# EAGLE design cowsynth_teensy_breakout_revA (EAGLE 9.4.0)
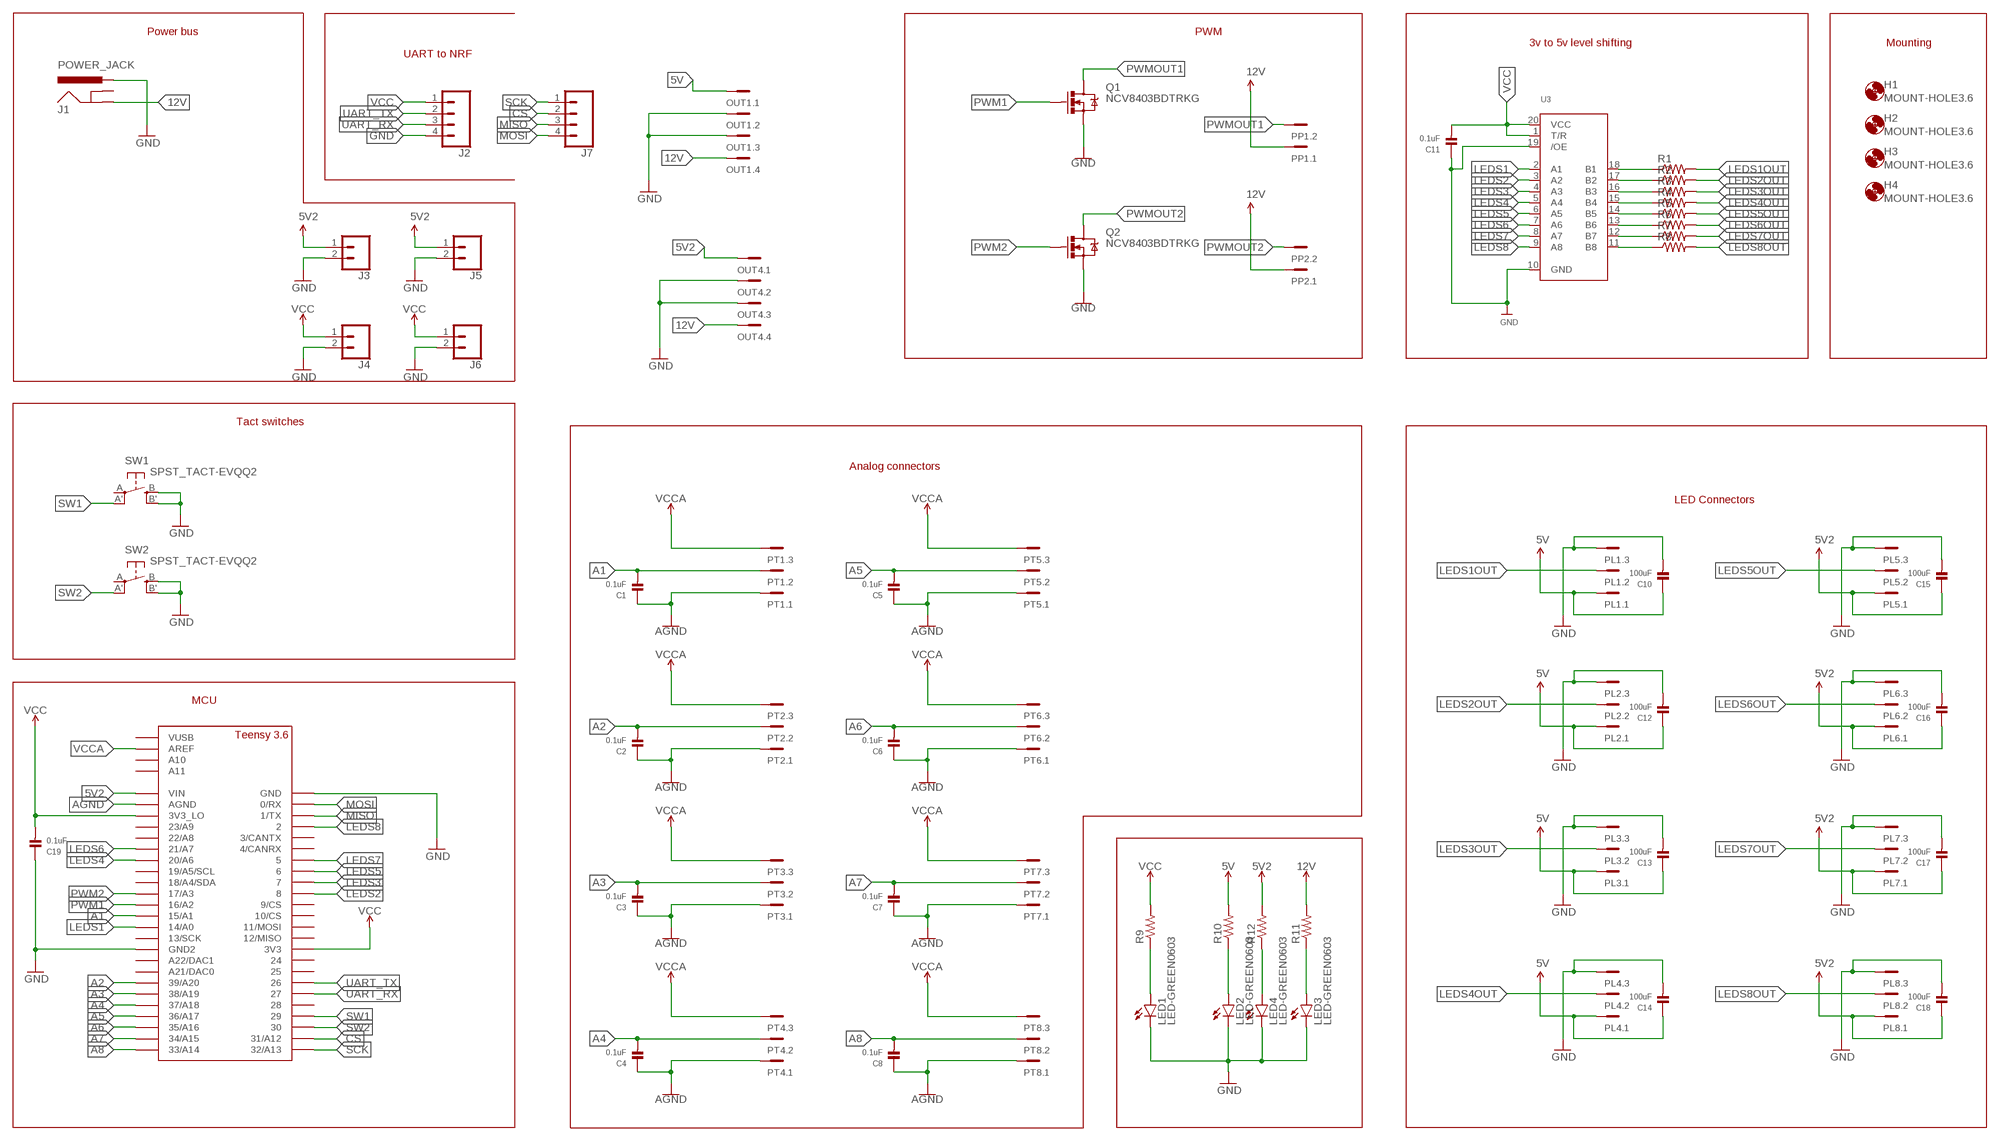
[diagram p0: schematic, sheet 1]

## Parts
C1  0.1uF  CAP_CERAMIC0603  [0603]
C2  0.1uF  CAP_CERAMIC0603  [0603]
C3  0.1uF  CAP_CERAMIC0603  [0603]
C4  0.1uF  CAP_CERAMIC0603  [0603]
C5  0.1uF  CAP_CERAMIC0603  [0603]
C6  0.1uF  CAP_CERAMIC0603  [0603]
C7  0.1uF  CAP_CERAMIC0603  [0603]
C8  0.1uF  CAP_CERAMIC0603  [0603]
C10  100uF  CAP_CERAMIC1206  [1206]
C11  0.1uF  CAP_CERAMIC0603  [0603]
C12  100uF  CAP_CERAMIC1206  [1206]
C13  100uF  CAP_CERAMIC1206  [1206]
C14  100uF  CAP_CERAMIC1206  [1206]
C15  100uF  CAP_CERAMIC1206  [1206]
C16  100uF  CAP_CERAMIC1206  [1206]
C17  100uF  CAP_CERAMIC1206  [1206]
C18  100uF  CAP_CERAMIC1206  [1206]
C19  0.1uF  CAP_CERAMIC0603  [0603]
H1  MOUNT-HOLE3.6  [3,6]
H2  MOUNT-HOLE3.6  [3,6]
H3  MOUNT-HOLE3.6  [3,6]
H4  MOUNT-HOLE3.6  [3,6]
J1  POWER_JACK  [POWER_JACK_PTH]
J2  CONN_04  [1X04]
J3  CONN_02  [1X02]
J4  CONN_02  [1X02]
J5  CONN_02  [1X02]
J6  CONN_02  [1X02]
J7  CONN_04  [1X04]
LED1  LED-GREEN0603  [0603-GREEN]
LED2  LED-GREEN0603  [0603-GREEN]
LED3  LED-GREEN0603  [0603-GREEN]
LED4  LED-GREEN0603  [0603-GREEN]
OUT1  MC4  [MC4]
OUT4  MC4  [MC4]
PL1  MC3  [MC3]
PL2  MC3  [MC3]
PL3  MC3  [MC3]
PL4  MC3  [MC3]
PL5  MC3  [MC3]
PL6  MC3  [MC3]
PL7  MC3  [MC3]
PL8  MC3  [MC3]
PP1  MC2  [MC2]
PP2  MC2  [MC2]
PT1  MC3  [MC3]
PT2  MC3  [MC3]
PT3  MC3  [MC3]
PT4  MC3  [MC3]
PT5  MC3  [MC3]
PT6  MC3  [MC3]
PT7  MC3  [MC3]
PT8  MC3  [MC3]
Q1  NCV8403BDTRKG  MOSFET-NCHANNELFDD8780  [DPAK]
Q2  NCV8403BDTRKG  MOSFET-NCHANNELFDD8780  [DPAK]
R1  R-US_R0603  [R0603]
R2  R-US_R0603  [R0603]
R3  R-US_R0603  [R0603]
R4  R-US_R0603  [R0603]
R5  R-US_R0603  [R0603]
R6  R-US_R0603  [R0603]
R7  R-US_R0603  [R0603]
R8  R-US_R0603  [R0603]
R9  R-US_R0603  [R0603]
R10  R-US_R0603  [R0603]
R11  R-US_R0603  [R0603]
R12  R-US_R0603  [R0603]
SW1  SPST_TACT-EVQQ2  [EVQ-Q2]
SW2  SPST_TACT-EVQQ2  [EVQ-Q2]
U3  74LCX245  [TSSOP20]
U$1  TEENSY_3.5/3.6_BASIC  [TEENSY_3.5/3.6_BASIC]

## Nets
5V: C10.1 C12.1 C13.1 C14.1 OUT1.1 PL1.1 PL2.1 PL3.1 PL4.1 R10.2
5V2: C15.1 C16.1 C17.1 C18.1 J3.1 J5.1 OUT4.1 PL5.1 PL6.1 PL7.1 PL8.1 R12.2 U$1.VIN
12V: J1.GND OUT1.4 OUT4.4 PP1.1 PP2.1 R11.2
A1: C1.2 PT1.2 U$1.15/A1
A2: C2.2 PT2.2 U$1.39/A20
A3: C3.2 PT3.2 U$1.38/A19
A4: C4.2 PT4.2 U$1.37/A18
A5: C5.2 PT5.2 U$1.36/A17
A6: C6.2 PT6.2 U$1.35/A16
A7: C7.2 PT7.2 U$1.34/A15
A8: C8.2 PT8.2 U$1.33/A14
AGND: C1.1 C2.1 C3.1 C4.1 C5.1 C6.1 C7.1 C8.1 PT1.1 PT2.1 PT3.1 PT4.1 PT5.1 PT6.1 PT7.1 PT8.1 U$1.AGND
CS: J7.2 U$1.31/A12
GND: C10.2 C11.1 C12.2 C13.2 C14.2 C15.2 C16.2 C17.2 C18.2 C19.1 J1.PWR J2.4 J3.2 J4.2 J5.2 J6.2 LED1.C LED2.C LED3.C LED4.C OUT1.2 OUT1.3 OUT4.2 OUT4.3 PL1.3 PL2.3 PL3.3 PL4.3 PL5.3 PL6.3 PL7.3 PL8.3 Q1.3(S) Q2.3(S) SW1.B'(S1) SW1.B(S) SW2.B'(S1) SW2.B(S) U3.10(GND) U3.19(/OE) U$1.GND U$1.GND2
LEDS1: U3.2(A1) U$1.14/A0
LEDS1OUT: PL1.2 R1.2
LEDS2: U3.3(A2) U$1.8
LEDS2OUT: PL2.2 R2.2
LEDS3: U3.4(A3) U$1.7
LEDS3OUT: PL3.2 R3.2
LEDS4: U3.5(A4) U$1.20/A6
LEDS4OUT: PL4.2 R4.2
LEDS5: U3.6(A5) U$1.6
LEDS5OUT: PL5.2 R5.2
LEDS6: U3.7(A6) U$1.21/A7
LEDS6OUT: PL6.2 R6.2
LEDS7: U3.8(A7) U$1.5
LEDS7OUT: PL7.2 R7.2
LEDS8: U3.9(A8) U$1.2
LEDS8OUT: PL8.2 R8.2
MISO: J7.3 U$1.1/TX
MOSI: J7.4 U$1.0/RX
N$1: LED4.A R12.1
N$2: LED1.A R9.1
N$3: LED2.A R10.1
N$4: LED3.A R11.1
N$5: R1.1 U3.18(B1)
N$6: R2.1 U3.17(B2)
N$7: R3.1 U3.16(B3)
N$8: R4.1 U3.15(B4)
N$9: R5.1 U3.14(B5)
N$10: R6.1 U3.13(B6)
N$11: R7.1 U3.12(B7)
N$12: R8.1 U3.11(B8)
PWM1: Q1.1(G) U$1.16/A2
PWM2: Q2.1(G) U$1.17/A3
PWMOUT1: PP1.2 Q1.4(D)
PWMOUT2: PP2.2 Q2.4(D)
SCK: J7.1 U$1.32/A13
SW1: SW1.A'(P1) U$1.29
SW2: SW2.A'(P1) U$1.30
UART_RX: J2.3 U$1.27
UART_TX: J2.2 U$1.26
VCC: C11.2 C19.2 J2.1 J4.1 J6.1 R9.2 U3.1(T/R) U3.20(VCC) U$1.3V3 U$1.3V3_LO
VCCA: PT1.3 PT2.3 PT3.3 PT4.3 PT5.3 PT6.3 PT7.3 PT8.3 U$1.AREF
Unconnected: J1.GNDBREAK SW1.A(P) SW2.A(P) U$1.3/CANTX U$1.4/CANRX U$1.9/CS U$1.10/CS U$1.11/MOSI U$1.12/MISO U$1.13/SCK U$1.18/A4/SDA U$1.19/A5/SCL U$1.21/DAC0(A21/DAC0) U$1.22/A8 U$1.23/A9 U$1.24 U$1.25 U$1.28 U$1.A10 U$1.A11 U$1.A22/DAC1 U$1.VUSB

## Notes on the sheet
- Power bus | PWM
- 3v to 5v level shifting | Mounting
- UART to NRF
- Tact switches
- Analog connectors
- LED Connectors
- MCU

## Library data of the parts
C1-C8 C10-C19 = microbuilder:CAP_CERAMIC: Ceramic Capacitors 0402 - 0402 Surface Mount Capacitors 16pF 50V 5% [Digikey: 445-4899-2-ND] 18pF 50V 5% [Digikey: 490-1281-2-ND] 22pF 50V 5% [Digikey: 490-1283-2-ND] 68pF 50V 5% [Digikey: 490-1289-2-ND] 0.1uF 10V 10% [Digikey: 490-1318-2-ND] 1.0uF 6.3V 10% [Digikey: 490-1320-2-ND] 0603 - 0603 Surface Mount Capacitors 16 pF 50V 5% [Digikey: 445-5051-2-ND] 22 pF 50V [Digikey: PCC220ACVTR-ND] 33 pF 50V 5% [Digikey: 490-1415-1-ND] 56pF 50V 5% [Digikey: 490-1421-1-ND] 220pF 50V 5% [Digikey: 445-1285-1-ND] 680 pF 50V 2200 pF 50V 5% C0G [Digikey: 445-1297-1-ND] 5600 pF 100V 5% X7R [Digikey: 478-3711-1-ND] 0.1 µF 25V 10% [Digikey: PCC2277TR-ND] 0.22 µF 16V 10% X7R [Digikey: 445-1318-1-ND] 1.0 µF 25V 10% [Digikey: 445-5146-2-ND] 0603 - RF Specific 3pF 250V +/-0.1pF RF [Digikey: 712-1347-1-ND] 18 pF 250V 5% [Digikey: 478-3505-1-ND or 712-1322-1-ND] 56 pF 250V 5% C0G RF [Digikey: 490-4867-1-ND] 68 pF 250V RF [Digikey: 490-4868-1-ND] 0805 - 0805 Surface Mount Capacitors 220 pF 250V 2% RF Ceramic Capacitor [Digikey: 712-1398-1-ND] 1000 pF 50V 2% NP0 Ceramic Capacitor [Digikey: 478-3760-1-ND] 0.1 µF 25V 10% Ceramic Capacitor [Digikey: PCC1828TR-ND] 1.0 µF 16V 10% Ceramic Capacitor[Digikey: 490-1691-2-ND] 10.0 µF 10V 10% Ceramic Capacitor[Digikey: 709-1228-1-ND] 10.0 uF 16V 10% Ceramic Capacitor [Digikey: 478-5165-2-ND] 47 uF 6.3V 20% Ceramic Capacitor [Digikey: 587-1779-1-ND or 399-5506-1-ND] 1206 - 1206 Surface Mount Capacitors 47uF 10V 20% Ceramic Capacitor [Digikey: 490-5528-1-ND or 399-5508-1-ND or 445-6010-1-ND] 100uF 6.3V -20%, +80% Y5V Ceramic Capacitor (Digikey: 490-4512-1-ND, Mouser: 81-GRM31CF50J107ZE1L)
H1-H4 = holes:MOUNT-HOLE: MOUNTING HOLE with drill center marker
J1 = SparkFun-Connectors:POWER_JACK: Power Jack Connector This is the standard 5.5mm barrel jack for power. The PTH is the most common, proven, reliable, footprint. The Slot footprint only works if the mill layer is transmitted to the PCB fab house so be warned. Here are the connectors we sell at SparkFun: DC Barrel Power Jack/Connector <https://www.sparkfun.com/products/119> (PRT-00119) DC Barrel Power Jack/Connector (SMD) <https://www.sparkfun.com/products/12748> (PRT-12748) DC Barrel Jack Adapter - Breadboard Compatible <https://www.sparkfun.com/products/10811> (PRT-10811) It is used on this SparkFun product (and many, many others): SparkFun RedBoard - Programmed with Arduino <https://www.sparkfun.com/products/12757> (DEV-12757) Also, if you need a mating power supply or connector, please check these out: Wall Adapter Power Supply - 9VDC 650mA <https://www.sparkfun.com/products/298> (TOL-00298) DC Barrel Jack Adapter - Male <https://www.sparkfun.com/products/10287> (PRT-10287); PROD_ID: CONN-08197
J2 J7 = SparkFun-Connectors:CONN_04: Multi connection point. Often used as Generic Header-pin footprint for 0.1 inch spaced/style header connections On any of the 0.1 inch spaced packages, you can populate with these: Break Away Headers - Straight <https://www.sparkfun.com/products/116> (PRT-00116) Break Away Male Headers - Right Angle <https://www.sparkfun.com/products/553> (PRT-00553) Female Headers <https://www.sparkfun.com/products/115> (PRT-00115) Break Away Headers - Machine Pin <https://www.sparkfun.com/products/117> (PRT-00117) Break Away Female Headers - Swiss Machine Pin <https://www.sparkfun.com/products/743> (PRT-00743) For SCREWTERMINALS and SPRING TERMINALS visit here: Screw Terimnals on SparkFun.com <https://www.sparkfun.com/search/results?term=Screw+Terminals> (5mm/3.5mm/2.54mm spacing) This device is also useful as a general connection point to wire up your design to another part of your project. Our various solder wires solder well into these plated through hole pads. Hook-Up Wire - Assortment (Stranded, 22 AWG) <https://www.sparkfun.com/products/11375> (PRT-11375) Hook-Up Wire - Assortment (Solid Core, 22 AWG) <https://www.sparkfun.com/products/11367> (PRT-11367) View the entire wire category on our website here <https://www.sparkfun.com/categories/141> Special notes: Molex polarized connector foot print use with SKU : PRT-08231 with associated crimp pins and housings. 1MM SMD Version SKU: PRT-10208; PROD_ID: CONN-09696
J3-J6 = SparkFun-Connectors:CONN_02: Multi connection point. Often used as Generic Header-pin footprint for 0.1 inch spaced/style header connections On any of the 0.1 inch spaced packages, you can populate with these: Break Away Headers - Straight <https://www.sparkfun.com/products/116> (PRT-00116) Break Away Male Headers - Right Angle <https://www.sparkfun.com/products/553> (PRT-00553) Female Headers <https://www.sparkfun.com/products/115> (PRT-00115) Break Away Headers - Machine Pin <https://www.sparkfun.com/products/117> (PRT-00117) Break Away Female Headers - Swiss Machine Pin <https://www.sparkfun.com/products/743> (PRT-00743) For SCREWTERMINALS and SPRING TERMINALS visit here: Screw Terimnals on SparkFun.com <https://www.sparkfun.com/search/results?term=Screw+Terminals> (5mm/3.5mm/2.54mm spacing) This device is also useful as a general connection point to wire up your design to another part of your project. Our various solder wires solder well into these plated through hole pads. Hook-Up Wire - Assortment (Stranded, 22 AWG) <https://www.sparkfun.com/products/11375> (PRT-11375) Hook-Up Wire - Assortment (Solid Core, 22 AWG) <https://www.sparkfun.com/products/11367> (PRT-11367) View the entire wire category on our website here <https://www.sparkfun.com/categories/141> Special notes: Molex polarized connector foot print use with: PRT-08233 with associated crimp pins and housings. 2.54_SCREWTERM for use with PRT-10571. 3.5mm Screw Terminal footprints for PRT-08084 5mm Screw Terminal footprints for use with PRT-08432
LED1-LED4 = BeagleBone_Blue_R3:LED-GREEN
OUT1 OUT4 = con-phoenix-381_l:MC4: Mini-Combicon 3.81mm horizontal 4-polig (ohne Gegenstecker)
PL1-PL8 PT1-PT8 = con-phoenix-381_l:MC3: Mini-Combicon 3.81mm horizontal 3-polig (ohne Gegenstecker)
PP1 PP2 = con-phoenix-381_l:MC2: Mini-Combicon 3.81mm horizontal 2-polig (ohne Gegenstecker)
Q1 Q2 = BeagleBone_Blue_R3:MOSFET-NCHANNEL: Common NMOSFET Parts MFG P/N Store ID Prod ID FDD8780 TRANS-09984 SI7820DN TRANS-11055 FDS6630A IC-08089 2N7002PW TRANS-11151 FQP30N06L COM-10213 TRANS-10060 BSS123LT1G TRANS-08345 BSS138 TRANS-00830 BS170 2N7000; PROD_ID: TRANS-09984
R1-R12 = adafruit:R-US_: RESISTOR, American symbol
SW1 SW2 = adafruit:SPST_TACT: SMT 6mm switch, EVQQ2 series http://www.ladyada.net/library/eagle
U3 = microbuilder:74LCX245: 74LCX245MTC - 5.0V Tolerant Bi-Directional Buffer Can be used to interface 5.0V logic to 2.5 or 3.3V devices Digikey: 74LCX245MTCXTR-ND Mouser: 512-74LCX245MTCX
U$1 = Teensy356:TEENSY_3.5/3.6_BASIC

## Board
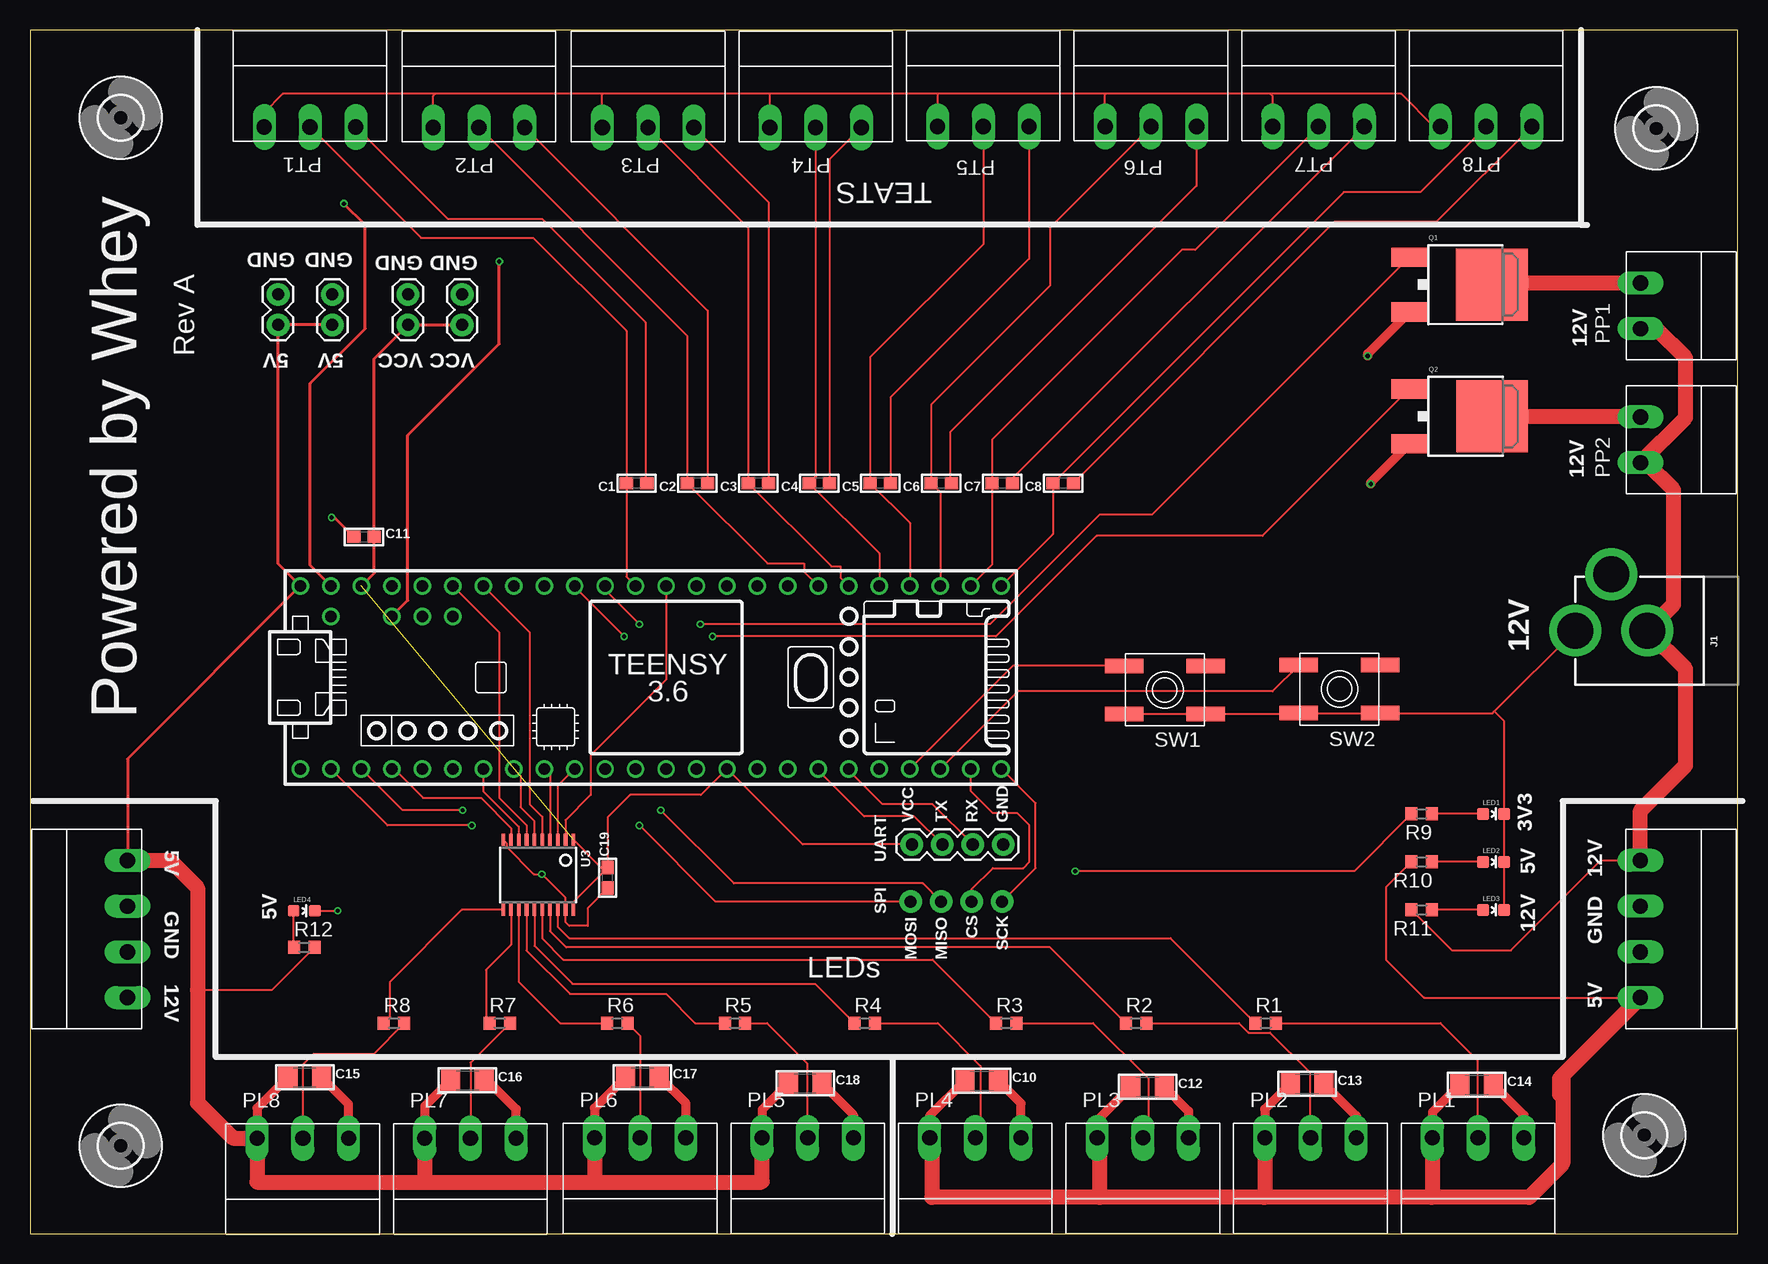
[diagram p1: board, top side]
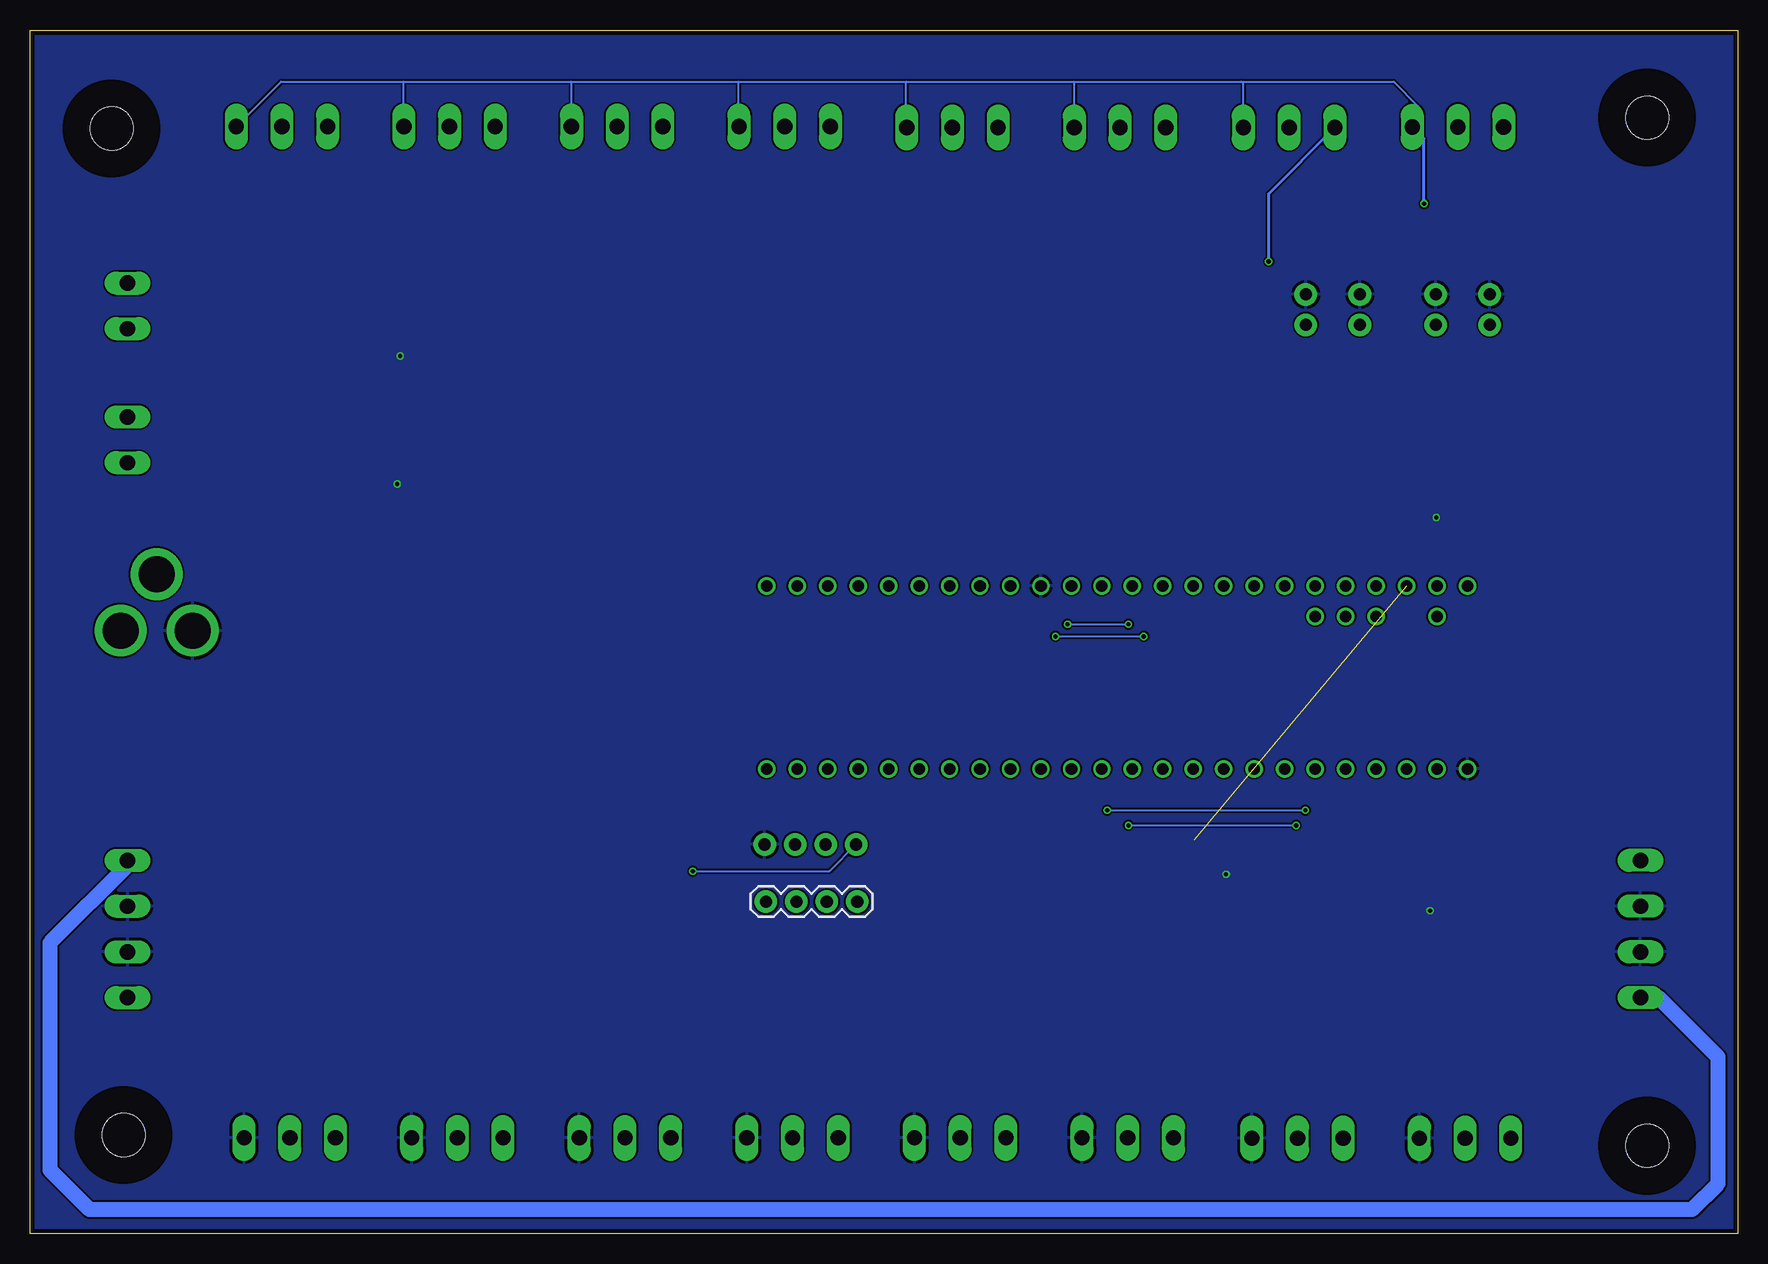
[diagram p2: board, bottom side, seen from below]

Size 142.37 x 100.32 mm. Coordinates in mm from the lower left corner, seen from the top.
Outline: 0,0 142.37,0 142.37,100.32 0,100.32 0,0
Copper layers (1*16): Top 0.035559375mm / dielectric 1.6mm / Bottom 0.035559375mm
Design rules "oshpark-2layer": minimum track width 6mil, minimum drill 10mil, track to track 6mil, track to pad 6mil, pad to pad 6mil, via to via 6mil, smd to smd 6mil, copper to edge 15mil, drill to drill 6mil, minimum pad ring 5mil, minimum via ring 5mil, stop-mask expansion 2.5mil, vias tented up to drill 0mil, thermal gap 10mil

### Footprints (pad centres in the part's own frame; a part is rotated, then mirrored left to right if it is on the bottom)
0603 = smd 1.1 x 1: 1 -0.85,0; 2 0.85,0
1206 = smd 1.6 x 1.8: 1 -1.4,0; 2 1.4,0
3,6 = hole 3.6: 0,0
POWER_JACK_PTH = drill 2.997 pad 4.318: GND 0,7.7; GNDBREAK 4.7,10.7; PWR 0,13.7
1X04 = drill 1.016 pad 1.88: 1 0,0; 2 2.54,0; 3 5.08,0; 4 7.62,0
1X02 = drill 1.016 pad 1.88: 1 0,0; 2 2.54,0
0603-GREEN = smd 1 x 1: A 0,-0.877; C 0,0.877
MC4 = drill 1.27 long: 1 -5.715,0; 2 -1.905,0; 3 1.905,0; 4 5.715,0
MC3 = drill 1.27 long: 1 -3.81,0; 2 0,0; 3 3.81,0
MC2 = drill 1.27 long: 1 -1.905,0; 2 1.905,0
DPAK = smd 1.6 x 2.997: 1 -2.28,-5.31; 3 2.28,-5.31 | smd 5.994 x 5.994: 4 0,1.588
R0603 = smd 1 x 1.1: 1 -0.85,0; 2 0.85,0
EVQ-Q2 = smd 3.2 x 1.2: A -3.4,-2; A' 3.4,-2; B -3.4,2; B' 3.4,2
TSSOP20 = smd 0.305 x 0.991: 1 -2.925,-2.918; 2 -2.275,-2.918; 3 -1.625,-2.918; 4 -0.975,-2.918; 5 -0.325,-2.918; 6 0.325,-2.918; 7 0.975,-2.918; 8 1.625,-2.918; 9 2.275,-2.918; 10 2.925,-2.918; 11 2.925,2.918; 12 2.275,2.918; 13 1.625,2.918; 14 0.975,2.918; 15 0.325,2.918; 16 -0.325,2.918; 17 -0.975,2.918; 18 -1.625,2.918; 19 -2.275,2.918; 20 -2.925,2.918
TEENSY_3.5/3.6_BASIC = drill 0.965: 0/RX -25.4,-7.62; 1/TX -22.86,-7.62; 2 -20.32,-7.62; 3/CANTX -17.78,-7.62; 3V3 7.62,-7.62; 3V3_LO -22.86,7.62; 4/CANRX -15.24,-7.62; 5 -12.7,-7.62; 6 -10.16,-7.62; 7 -7.62,-7.62; 8 -5.08,-7.62; 9/CS -2.54,-7.62; 10/CS 0,-7.62; 11/MOSI 2.54,-7.62; 12/MISO 5.08,-7.62; 13/SCK 5.08,7.62; 14/A0 2.54,7.62; 15/A1 0,7.62; 16/A2 -2.54,7.62; 17/A3 -5.08,7.62; 18/A4/SDA -7.62,7.62; 19/A5/SCL -10.16,7.62; 20/A6 -12.7,7.62; 21/A7 -15.24,7.62; 21/DAC0 12.7,7.62; 22/A8 -17.78,7.62; 23/A9 -20.32,7.62; 24 10.16,-7.62; 25 12.7,-7.62; 26 15.24,-7.62; 27 17.78,-7.62; 28 20.32,-7.62; 29 22.86,-7.62; 30 25.4,-7.62; 31/A12 27.94,-7.62; 32/A13 30.48,-7.62; 33/A14 30.48,7.62; 34/A15 27.94,7.62; 35/A16 25.4,7.62; 36/A17 22.86,7.62; 37/A18 20.32,7.62; 38/A19 17.78,7.62; 39/A20 15.24,7.62; A10 -17.78,5.08; A11 -15.24,5.08; A22/DAC1 10.16,7.62; AGND -25.4,7.62; AREF -20.32,5.08; GND -27.94,-7.62; GND2 7.62,7.62; VIN -27.94,7.62; VUSB -25.4,5.08

### Placement (x,y rotation side)
C1  50.56,62.56 180 top
C2  55.64,62.56 180 top
C3  60.72,62.56 180 top
C4  65.8,62.56 180 top
C5  70.88,62.56 180 top
C6  75.96,62.56 180 top
C7  81.04,62.56 180 top
C8  86.12,62.56 180 top
C10  79.33,12.76 0 top
C11  27.85,58.07 0 top
C12  93.16,12.25 0 top
C13  106.46,12.5 0 top
C14  120.58,12.42 0 top
C15  22.91,13.06 0 top
C16  36.47,12.8 0 top
C17  51.04,13.06 0 top
C18  64.61,12.55 0 top
C19  48.16,29.67 90 top
H1  7.56,93.01 0 top
H2  135.56,92.12 0 top
H3  134.56,8.23 0 top
H4  7.56,7.34 0 top
J1  142.51,50.27 90 top
J2  73.51,32.45 0 top
J3  25.19,75.75 90 top
J4  36.02,75.75 90 top
J5  20.69,75.75 90 top
J6  31.51,75.75 90 top
J7  81.03,27.69 0 bottom
LED1  122,35 270 top
LED2  122,31 270 top
LED3  122,27 270 top
LED4  22.86,26.92 270 top
OUT1  134.24,25.4 90 top
OUT4  8.13,25.4 270 top
PL1  120.71,8 0 top
PL2  106.74,8 0 top
PL3  92.77,8 0 top
PL4  78.8,8 0 top
PL5  64.83,8 0 top
PL6  50.86,8 0 top
PL7  36.71,7.97 0 top
PL8  22.74,7.97 0 top
PP1  134.25,77.33 90 top
PP2  134.25,66.17 90 top
PT1  23.34,92.25 180 top
PT2  37.42,92.2 180 top
PT3  51.52,92.2 180 top
PT4  65.49,92.2 180 top
PT5  79.46,92.28 180 top
PT6  93.43,92.28 180 top
PT7  107.4,92.28 180 top
PT8  121.37,92.28 180 top
Q1  120.28,79.1 270 top
Q2  120.29,68.13 270 top
R1  103.01,17.55 0 top
R2  92.2,17.55 0 top
R3  81.39,17.55 0 top
R4  69.58,17.55 0 top
R5  58.77,17.55 0 top
R6  48.96,17.55 0 top
R7  39.15,17.55 0 top
R8  30.34,17.55 0 top
R9  116,35 180 top
R10  116,31 180 top
R11  116,27 180 top
R12  22.86,23.88 0 top
SW1  94.6,45.34 180 top
SW2  109.16,45.4 180 top
U3  42.37,29.91 180 top
U$1  50.48,46.37 0 top

### Tracks (layer width: path | path; a pad name or v marks a point on that pad's centre or on a via)
5V
  Top 0.152: R10.2 113.03,28.88 113.03,22.86 116.2,19.68 OUT1.1
  Top 0.762: 74.99,9.71 PL4.1 74.99,9.82 C10.1 | 102.93,10.41 102.93,10.38 | 102.93,10.38 PL2.1 | C14.1 116.9,10.14 PL1.1 | C12.1 88.96,9.46 PL3.1 | C13.1 102.93,10.38
  Top 1.27: 127.51,11.59 127.51,12.95 127.76,13.21 | 127.76,13.21 127.76,5.84 124.97,3.05 116.84,3.05 | 116.84,3.05 102.87,3.05 | 102.87,3.05 89.15,3.05 | 89.15,3.05 75.18,3.05 75.18,7.81 PL4.1 | PL3.1 89.15,7.81 89.15,3.05 | PL2.1 102.93,3.11 102.87,3.05 | PL1.1 116.9,3.11 116.84,3.05 | OUT1.1 127.76,13.21
5V2
  Top 0.152: R12.2 20.15,20.32 13.97,20.32
  Top 0.254: OUT4.1 8.13,39.58 U$1.VIN 20.69,55.84 J5.1 J3.1
  Top 0.762: C18.1 61.02,10.36 PL5.1 | C17.1 47.05,10.47 PL6.1 | C16.1 32.9,10.64 PL7.1 | C15.1 18.93,10.48 PL8.1
  Top 1.27: OUT4.1 11.68,31.11 13.97,28.83 13.97,20.32 13.97,10.92 16.92,7.97 PL8.1 18.93,4.32 32.51,4.32 | 32.51,4.32 46.74,4.32 | 46.74,4.32 60.96,4.32 61.02,4.38 PL5.1 | PL6.1 47.05,4.63 46.74,4.32 | PL7.1 32.9,4.71 32.51,4.32
12V
  Top 0.152: R11.2 118.53,23.62 123.44,23.62 130.94,31.11 OUT1.4
  Top 1.27: PP1.1 135.57,75.43 138,73 138,68.02 PP2.1 134.73,64.27 137,62 137,52.46 J1.GND 138,47.08 138,39.03 134.24,35.27 OUT1.4
  Bottom 1.27: OUT1.4 134.24,30.72 140.72,24.24 140.72,5.34 137.41,2.03 3.81,2.03 1.65,4.19 1.65,14.73 6.6,19.68 OUT4.4
A1
  Top 0.152: PT1.2 32.59,83 41.95,83 49.71,75.24 C1.2 49.71,54.76 U$1.15/A1
A2
  Top 0.152: PT2.2 54.79,74.83 C2.2 61.47,55.88 64.52,55.88 64.52,55.19 U$1.39/A20
A3
  Top 0.152: PT3.2 59.87,83.85 C3.2 66.8,55.63 67.56,55.63 67.56,54.69 U$1.38/A19
A4
  Top 0.152: PT4.2 65.49,63.1 | C4.2 70.8,56.71 U$1.37/A18
  Top 0.254: 65.49,63.1 C4.2
A5
  Top 0.152: PT5.2 79.46,82.46 70.03,73.03 C5.2 73.34,59.25 U$1.36/A17
A6
  Top 0.152: PT6.2 85,83.84 85,79 75.11,69.11 C6.2 75.88,61.79 U$1.35/A16
A7
  Top 0.152: PT7.2 97.13,82 96,82 80.19,66.19 C7.2 80.19,55.76 U$1.34/A15
A8
  Top 0.152: PT8.2 115.91,86.81 109.52,86.81 C8.2 85.27,58.3 U$1.33/A14
AGND  (via drill 0.35)
  Top 0.152: PT1.1 34.81,84.58 42.67,84.58 51.31,75.95 51.31,62.66 C1.1 | PT2.1 56.49,76.94 C2.1 | PT3.1 61.57,85.96 C3.1 | PT4.1 66.65,89.56 C4.1 | PT5.1 83.27,81.24 71.73,69.7 C5.1 | PT6.1 97.24,87.34 76.71,66.8 76.71,62.66 C6.1 | PT7.1 81.89,62.95 C7.1 | PT8.1 117.23,84.33 108.74,84.33 C8.1
  Top 0.254: U$1.AGND 23.37,55.7 23.37,70.87 27.94,75.44 27.94,84.07 v26.16,85.85
  Bottom 0.152: PT8.1 121.45,96.01 111.25,96.01 | PT1.1 26.85,91.95 26.67,91.95 26.67,93.98 28.7,96.01 41.4,96.01 | 111.25,96.01 97.28,96.01 | 97.28,96.01 83.31,96.01 | 83.31,96.01 69.34,96.01 | 69.34,96.01 55.37,96.01 | 55.37,96.01 41.4,96.01 | PT2.1 41.23,95.84 41.4,96.01 | PT3.1 55.33,95.97 55.37,96.01 | PT4.1 69.34,92.25 69.34,96.01 | PT5.1 83.31,92.32 83.31,96.01 | PT6.1 97.24,95.97 97.28,96.01 | PT7.1 111.21,95.97 111.25,96.01
  Bottom 0.254: v26.16,85.85 26.16,91.26 PT1.1
CS
  Top 0.152: 78.42,27.75 J7.2 78.49,28.7 80.26,30.48 82.8,30.48 83.31,30.99 83.31,34.04 82.3,35.05 80.26,35.05 78.42,36.9 U$1.31/A12
GND  (via drill 0.35)
  Top 0.152: C19.1 46.48,27.15 46.48,25.65 44.96,25.65 44.65,25.97 U3.19 44.65,28 v42.67,29.97 41.98,29.97 39.71,32.24 39.71,32.56 U3.10 | SW1.B' SW1.B 105.7,43.34 SW2.B' SW2.B 121.94,43.4 122.07,43.53 | 122.07,43.53 J1.PWR | LED3.C LED2.C LED1.C 122.88,42.73 122.07,43.53 | LED4.C v25.65,26.92
  Top 0.254: C11.1 25.38,59.69 v25.15,59.69
  Top 0.762: PL7.3 40.52,10.4 38.12,12.8 C16.2 | PL6.3 54.67,10.87 52.48,13.06 C17.2 | C18.2 68.64,9.92 PL5.3 | PL3.3 96.58,10.22 C12.2 | 110.55,9.87 110.55,9.81 | 110.55,9.81 PL2.3 | C14.2 124.52,9.89 PL1.3 | C15.2 26.55,10.81 PL8.3 | C10.2 82.61,10.87 PL4.3 | C13.2 110.55,9.81 | Q2.3 111.76,62.63 v111.76,62.48 | Q1.3 111.51,73.36 v111.51,73.15
  pour Bottom: 0,102 144,102 144,-3 -2,-3 -2,102
LEDS1
  Top 0.152: U$1.14/A0 53.02,46.16 46.74,39.88 46.74,36.58 44.65,34.48 U3.2
LEDS1OUT
  Top 0.152: R1.2 117.58,17.55 120.65,14.48 120.65,8.06 PL1.2
LEDS2
  Top 0.152: U$1.8 43.99,37.34 U3.3
LEDS2OUT
  Top 0.152: R2.2 100.79,17.55 101.56,16.77 103.37,16.77 106.68,13.46 106.68,8.06 PL2.2
LEDS3
  Top 0.152: U$1.7 43.34,38.27 U3.4
LEDS3OUT
  Top 0.152: 91.82,8 PL3.2 93.22,8.45 93.22,12.95 88.62,17.55 R3.2
LEDS4
  Top 0.152: U$1.20/A6 41.66,50.11 41.66,35.81 42.7,34.77 U3.5
LEDS4OUT
  Top 0.152: R4.2 75.67,17.55 79.25,13.97 79.25,8.45 PL4.2
LEDS5
  Top 0.152: U$1.6 40.89,38.18 40.89,35.56 42.04,34.42 U3.6
LEDS5OUT
  Top 0.152: R5.2 61.44,17.55 64.77,14.22 64.77,8.06 PL5.2
LEDS6
  Top 0.152: U$1.21/A7 39.12,50.11 39.12,36.32 41.4,34.04 41.4,32.84 U3.7
LEDS6OUT
  Top 0.152: R6.2 50.86,16.5 PL6.2
LEDS7
  Top 0.152: U$1.5 37.78,36.9 40.74,33.93 U3.8
LEDS7OUT
  Top 0.152: R7.2 36.71,14.26 PL7.2
LEDS8
  Top 0.152: U$1.2 30.34,38.75 32.77,36.32 37.59,36.32 40.09,33.82 U3.9
LEDS8OUT
  Top 0.152: R8.2 28.63,14.99 23.62,14.99 22.74,14.11 PL8.2
MISO  (via drill 0.35)
  Top 0.152: J7.3 74.42,29.21 58.67,29.21 v52.58,35.31 | v36.07,35.31 31.06,35.31 U$1.1/TX
  Bottom 0.152: v52.58,35.31 v36.07,35.31
MOSI  (via drill 0.35)
  Top 0.152: J7.4 57.15,27.69 v50.8,34.04 | v36.83,34.04 29.79,34.04 U$1.0/RX
  Bottom 0.152: v50.8,34.04 v36.83,34.04
N$1
  Top 0.152: R12.1 21.98,23.9 LED4.A
N$2
  Top 0.152: LED1.A R9.1
N$3
  Top 0.152: LED2.A R10.1
N$4
  Top 0.152: LED3.A R11.1
N$5
  Top 0.152: U3.18 43.99,25.6 44.96,24.64 95.07,24.64 R1.1
N$6
  Top 0.152: U3.17 43.34,25.23 44.7,23.88 85.02,23.88 R2.1
N$7
  Top 0.152: U3.16 42.7,24.61 44.45,22.86 75.23,22.86 R3.1
N$8
  Top 0.152: U3.15 42.05,24 45.21,20.83 65.45,20.83 R4.1
N$9
  Top 0.152: U3.14 41.4,23.61 45,20 53,20 55.45,17.55 R5.1
N$10
  Top 0.152: U3.13 40.74,21 44.2,17.55 R6.1
N$11
  Top 0.152: U3.12 40.09,24.09 38,22 38,17.85
  Top 0.254: 38.3,17.4 R7.1 38,17.85
N$12
  Top 0.152: U3.11 35.99,26.99 30,21 30,18.06
  Top 0.254: R8.1 30,18.06
PWM1  (via drill 0.35)
  Top 0.152: Q1.1 93.53,59.94 89.15,59.94 80.01,50.8 v55.88,50.8 | v50.8,50.8 47.94,53.66 U$1.16/A2
  Bottom 0.152: v55.88,50.8 v50.8,50.8
PWM2  (via drill 0.35)
  Top 0.152: Q2.1 102.74,58.17 88.9,58.17 80.52,49.78 v56.9,49.78 | v49.53,49.78 45.4,53.91 U$1.17/A3
  Bottom 0.152: v56.9,49.78 v49.53,49.78
PWMOUT1
  Top 1.27: PP1.2 121,79.24 121.14,79.1 Q1.4
PWMOUT2
  Top 1.27: Q2.4 134.19,68.13 PP2.2
SCK
  Top 0.152: 80.96,27.75 J7.1 83.82,30.48 83.82,35.89 U$1.32/A13
SW1
  Top 0.152: SW1.A' 81.93,47.34 U$1.29
SW2
  Top 0.152: SW2.A' 103.57,45.21 82.34,45.21 U$1.30
UART_RX
  Top 0.152: 68.26,38.46 68.26,38.61 | 68.26,38.61 U$1.27 | J2.3 75.22,35.81 71.05,35.81 68.26,38.61
UART_TX
  Top 0.152: 65.72,38.46 65.72,38.61 | 65.72,38.61 U$1.26 | J2.2 73.7,34.8 69.53,34.8 65.72,38.61
VCC  (via drill 0.35)  (1 unrouted)
  Top 0.152: C19.2 45.3,27.66 U3.20 | C19.2 47.6,30.52 U3.1 | R9.2 110.38,30.23 v87.12,30.23 | C19.2 48.16,34.7 50.04,36.58 55.93,36.58 U$1.3V3 64.4,32.45 J2.1
  Top 0.254: U$1.3V3_LO 28.7,55.07 C11.2 28.7,72.93 J6.1 J4.1
  Bottom 0.152: v87.12,30.23 75.73,30.23 J2.1
VCCA  (via drill 0.35)
  Top 0.152: PT8.3 117.02,92.28 114.3,95 103.38,95 | 103.38,95 89.66,95 | 89.66,95 75.69,95 | 75.69,95 61.72,95 | 61.72,95 47.75,95 | 47.75,95 33.78,95 | 33.78,95 21.08,95 19.53,93.44 PT1.3 | PT2.3 33.61,94.82 33.78,95 | PT3.3 47.71,94.95 47.75,95 | PT4.3 61.68,94.95 61.72,95 | PT5.3 75.69,92.32 75.69,95 | PT6.3 89.62,94.96 89.66,95 | PT7.3 103.59,94.78 103.38,95
  Top 0.254: U$1.AREF 31.5,52.79 31.5,66.55 39.12,74.17 v39.12,81.03
  Bottom 0.254: v39.12,81.03 39.12,86.69 PT2.3

### Text on the board
tPlace: TEATS | GND | GND | GND | GND | 12V | Rev A | 5V | 5V | VCC | VCC | 12V | 12V | Powered by Whey | VCC | TX | RX | GND | 3V3 | 5V | UART | 5V | 12V | GND | SPI | 5V | CS | 12V | SCK | GND | MOSI | MISO | 12V | LEDs | 5V